# EAGLE design ESP07_Tool (EAGLE 7.3.0)
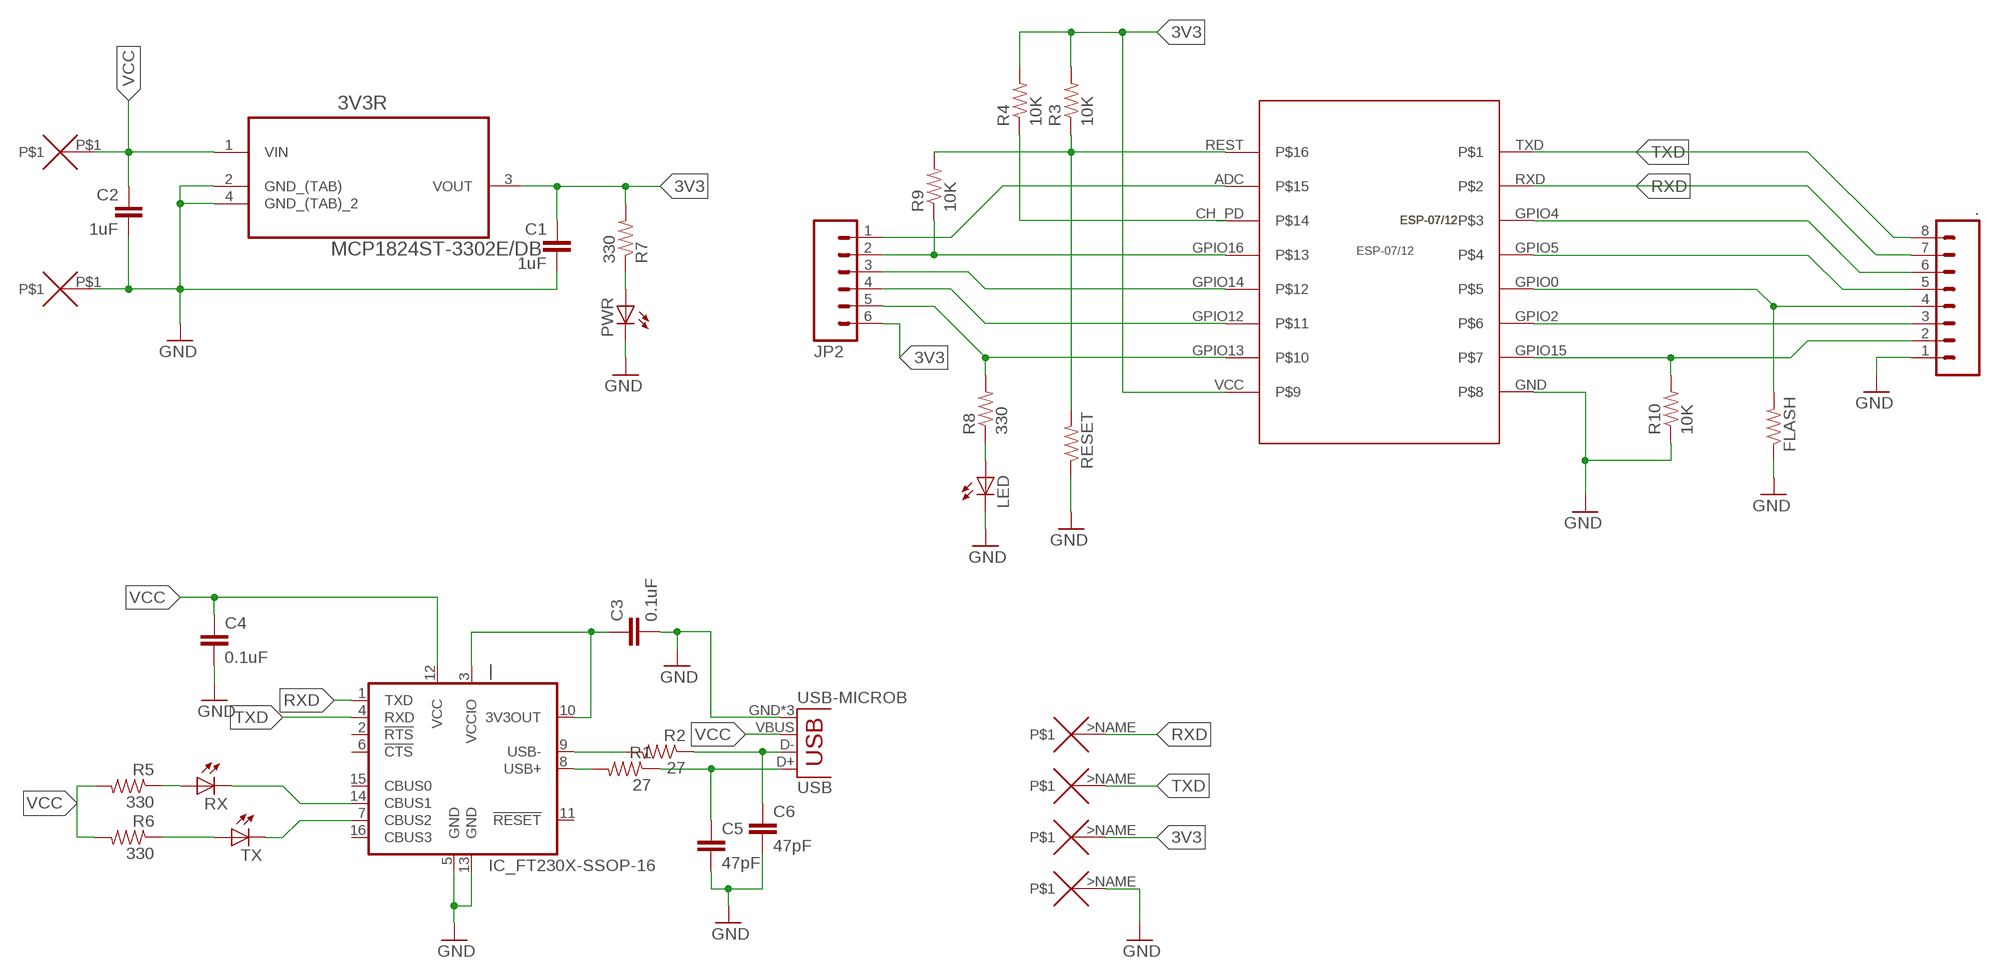
[diagram p0: schematic, sheet 1]

## Parts
3V3R  MCP1824ST-3302E/DB  [SOT230P700X180-4N]
.  M08SILK_FEMALE_PTH  [1X08]
C1  1uF  CAP  [0805-CAP]
C2  1uF  CAP  [0805-CAP]
C3  0.1uF  CAP  [0805-CAP]
C4  0.1uF  CAP  [0805-CAP]
C5  47pF  CAP  [0805-CAP]
C6  47pF  CAP  [0805-CAP]
FLASH  RESISTOR2010  [R2010]
JP2  M06SILK_FEMALE_PTH  [1X06]
LED  LEDCHIPLED_0805  [CHIPLED_0805]
PWR  LEDCHIPLED_0805  [CHIPLED_0805]
R1  27  RESISTOR0805-RES  [0805]
R2  27  RESISTOR0805-RES  [0805]
R3  10K  RESISTOR0805-RES  [0805]
R4  10K  RESISTOR0805-RES  [0805]
R5  330  RESISTOR0805-RES  [0805]
R6  330  RESISTOR0805-RES  [0805]
R7  330  RESISTOR0805-RES  [0805]
R8  330  RESISTOR0805-RES  [0805]
R9  10K  RESISTOR0805-RES  [0805]
R10  10K  RESISTOR0805-RES  [0805]
RESET  RESISTOR2010  [R2010]
RX  LEDCHIPLED_0805  [CHIPLED_0805]
TX  LEDCHIPLED_0805  [CHIPLED_0805]
U$1  ESP-07/12  [ESP-07/12]
U$2  SMD-PAD-SM  [SMD-PAD3]
U$3  SMD-PAD-SM  [SMD-PAD3]
U$4  SMD-PAD1  [SMD-PAD1]
U$5  SMD-PAD1  [SMD-PAD1]
U$6  SMD-PAD1  [SMD-PAD1]
U$7  SMD-PAD1  [SMD-PAD1]
USB  USB-MICROB  [USB-MICROB]
|  IC_FT230X-SSOP-16  [SSOP-16-FTDI]

## Nets
3V3: 3V3R.3(VOUT) C1.1 JP2.6 R3.2 R4.2 R7.2 U$1.VCC U$6.>NAME
GND: 3V3R.2(GND_(TAB)) 3V3R.4(GND_(TAB)_2) ..1 C1.2 C2.2 C3.2 C4.2 C5.2 C6.2 FLASH.1 LED.C PWR.C R10.1 RESET.1 U$1.GND U$2.P$1 U$7.>NAME USB.GND USB.MT1(GND) USB.MT2(GND) |.5(GND) |.13(GND)
N$1: JP2.3 U$1.GPIO14
N$2: LED.A R8.1
N$3: ..6 U$1.GPIO4
N$4: PWR.A R7.1
N$5: C3.1 |.3(VCCIO) |.10(3V3OUT)
N$6: TX.C |.7(CBUS2)
N$7: ..3 U$1.GPIO2
N$8: ..2 R10.2 U$1.GPIO15
N$9: ..5 U$1.GPIO5
N$10: ..4 FLASH.2 U$1.GPIO0
N$11: R4.1 U$1.CH_PD
N$12: JP2.1 U$1.ADC
N$13: RX.C |.14(CBUS1)
N$14: R5.1 RX.A
N$15: JP2.2 R9.1 U$1.GPIO16
N$17: JP2.4 U$1.GPIO12
N$18: JP2.5 R8.2 U$1.GPIO13
N$19: R6.1 TX.A
N$20: R2.2 |.9(USB-)
N$21: R1.2 |.8(USB+)
N$22: R3.1 R9.2 RESET.2 U$1.REST
N$23: C6.1 R2.1 USB.D-
N$26: C5.1 R1.1 USB.D+
RXD: ..7 U$1.RXD U$4.>NAME |.1(TXD)
TXD: ..8 U$1.TXD U$5.>NAME |.4(RXD)
VCC: 3V3R.1(VIN) C2.1 C4.1 R5.2 R6.2 U$3.P$1 USB.VBUS |.12(VCC)
Unconnected: |.2(!RTS) |.6(!CTS) |.11(!RESET) |.15(CBUS0) |.16(CBUS3)

## Library data of the parts
3V3R = Microchip_By_element14_Batch_1:MCP1824ST-3302E/DB: IC, LDO VOLT REG, 3.3V, 0.3A,; MPN: MCP1824ST-3302E/DB; OC_FARNELL: 1578379; OC_NEWARK: 05N1293; PACKAGE: SOT-223-3; SUPPLIER: Microchip
. = SparkFun-Connectors:M08: Header 8 Standard 8-pin 0.1" header. Use with straight break away headers (SKU : PRT-00116), right angle break away headers (PRT-00553), swiss pins (PRT-00743), machine pins (PRT-00117), and female headers (PRT-00115).; PROD_ID: CONN-08438
C1-C6 = SparkFun-Capacitors:CAP: Capacitor Standard 0603 ceramic capacitor, and 0.1" leaded capacitor.
FLASH R1-R10 RESET = SparkFun-Resistors:RESISTOR: Resistor Basic schematic elements and footprints for 0603, 1206, and PTH resistors.
JP2 = SparkFun-Connectors:M06: Header 6 Standard 6-pin 0.1" header. Use with straight break away headers (SKU : PRT-00116), right angle break away headers (PRT-00553), swiss pins (PRT-00743), machine pins (PRT-00117), and female headers (PRT-00115). Molex polarized connector foot print use with SKU : PRT-08094 with associated crimp pins and housings. NOTES ON THE VARIANTS LOCK and LOCK_LONGPADS... This footprint was designed to help hold the alignment of a through-hole component (i.e. 6-pin header) while soldering it into place. You may notice that each hole has been shifted either up or down by 0.005 of an inch from it's more standard position (which is a perfectly straight line). This slight alteration caused the pins (the squares in the middle) to touch the edges of the holes. Because they are alternating, it causes a "brace" to hold the component in place. 0.005 has proven to be the perfect amount of "off-center" position when using our standard breakaway headers. Although looks a little odd when you look at the bare footprint, once you have a header in there, the alteration is very hard to notice. Also,if you push a header all the way into place, it is covered up entirely on the bottom side. This idea of altering the position of holes to aid alignment will be further integrated into the Sparkfun Library for other footprints. It can help hold any component with 3 or more connection pins.; PROD_ID: CONN-08437
LED PWR RX TX = led:LED: LED OSRAM: - CHIPLED LG R971, LG N971, LY N971, LG Q971, LY Q971, LO R971, LY R971 LH N974, LH R974 LS Q976, LO Q976, LY Q976 LO Q996 - Hyper CHIPLED LW Q18S LB Q993, LB Q99A, LB R99A - SideLED LS A670, LO A670, LY A670, LG A670, LP A670 LB A673, LV A673, LT A673, LW A673 LH A674 LY A675 LS A676, LA A676, LO A676, LY A676, LW A676 LS A679, LY A679, LG A679 - Hyper Micro SIDELEDÂ® LS Y876, LA Y876, LO Y876, LY Y876 LT Y87S - SmartLED LW L88C, LW L88S LB L89C, LB L89S, LG L890 LS L89K, LO L89K, LY L89K LS L896, LA L896, LO L896, LY L896 - TOPLED LS T670, LO T670, LY T670, LG T670, LP T670 LSG T670, LSP T670, LSY T670, LOP T670, LYG T670 LG T671, LOG T671, LSG T671 LB T673, LV T673, LT T673, LW T673 LH T674 LS T676, LA T676, LO T676, LY T676, LB T676, LH T676, LSB T676, LW T676 LB T67C, LV T67C, LT T67C, LS T67K, LO T67K, LY T67K, LW E67C LS E67B, LA E67B, LO E67B, LY E67B, LB E67C, LV E67C, LT E67C LW T67C LS T679, LY T679, LG T679 LS T770, LO T770, LY T770, LG T770, LP T770 LB T773, LV T773, LT T773, LW T773 LH T774 LS E675, LA E675, LY E675, LS T675 LS T776, LA T776, LO T776, LY T776, LB T776 LHGB T686 LT T68C, LB T68C - Hyper Mini TOPLEDÂ® LB M676 - Mini TOPLED SantanaÂ® LG M470 LS M47K, LO M47K, LY M47K Source: http://www.osram.convergy.de LUXEON: - LUMILEDÂ® LXK2-PW12-R00, LXK2-PW12-S00, LXK2-PW14-U00, LXK2-PW14-V00 LXK2-PM12-R00, LXK2-PM12-S00, LXK2-PM14-U00 LXK2-PE12-Q00, LXK2-PE12-R00, LXK2-PE12-S00, LXK2-PE14-T00, LXK2-PE14-U00 LXK2-PB12-K00, LXK2-PB12-L00, LXK2-PB12-M00, LXK2-PB14-N00, LXK2-PB14-P00, LXK2-PB14-Q00 LXK2-PR12-L00, LXK2-PR12-M00, LXK2-PR14-Q00, LXK2-PR14-R00 LXK2-PD12-Q00, LXK2-PD12-R00, LXK2-PD12-S00 LXK2-PH12-R00, LXK2-PH12-S00 LXK2-PL12-P00, LXK2-PL12-Q00, LXK2-PL12-R00 Source: www.luxeon.com KINGBRIGHT: KA-3528ASYC Source: www.kingbright.com
U$1 = ESP-07_12:ESP-07/12: Version 1.0 of the library for the ESP-07/12 full GPIO dev board module byME Jon jonnyradu@gmail.com
U$2 U$3 = CuriousTech:SMD-PAD-SM: SMD-PAD
U$4-U$7 = CuriousTech:SMD-PAD1: SMD-PAD small
USB = SparkFun-Connectors:USB: USB Connectors USB-B-PTH is fully proven SKU : PRT-00139/CONN-08278 USB-miniB is fully proven SKU : PRT-00587 USB-A-PCB is untested. USB-A-H is throughly reviewed, but untested. Spark Fun Electronics SKU : PRT-00437 USB-B-SMT is throughly reviewed, but untested. Needs silkscreen touching up. USB-A-S has not been used/tested USB-MB-H has not been used/tested USB-MICROB has been used. CONN-09505; PROD_ID: CONN-09505
| = dp_devices:IC_FT230X: BASIC USB to UART IC

## Board
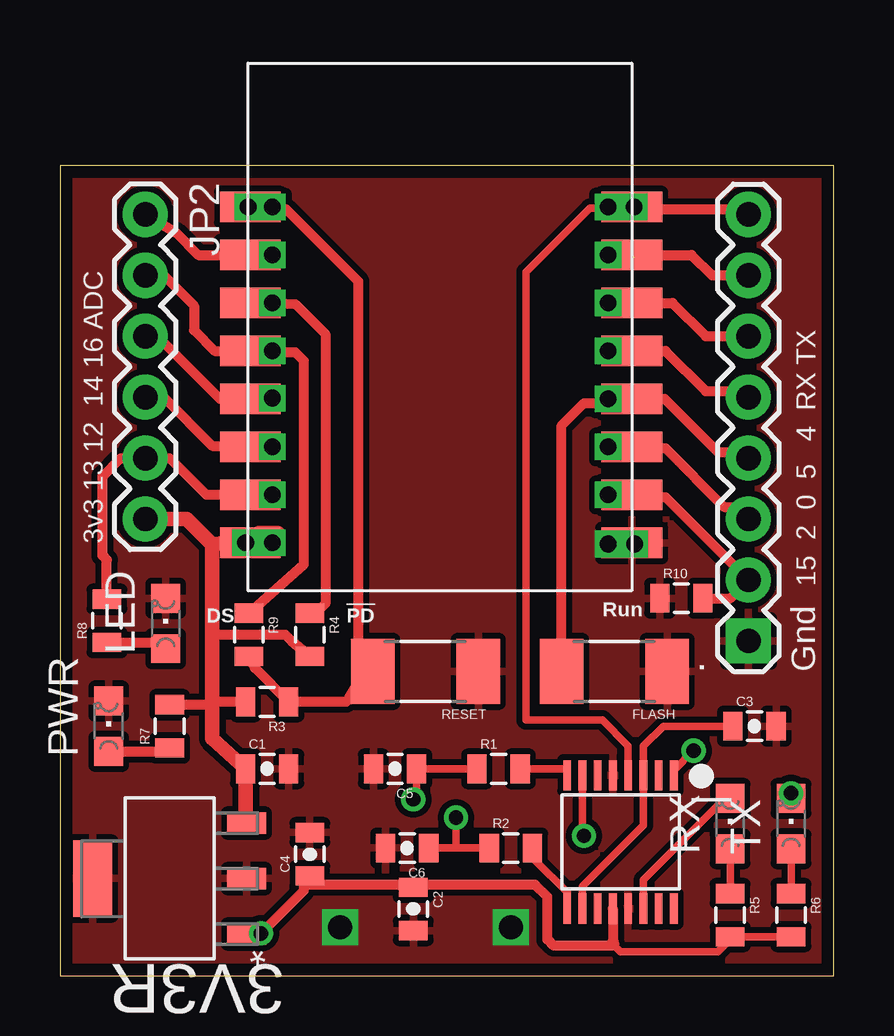
[diagram p1: board, top side]
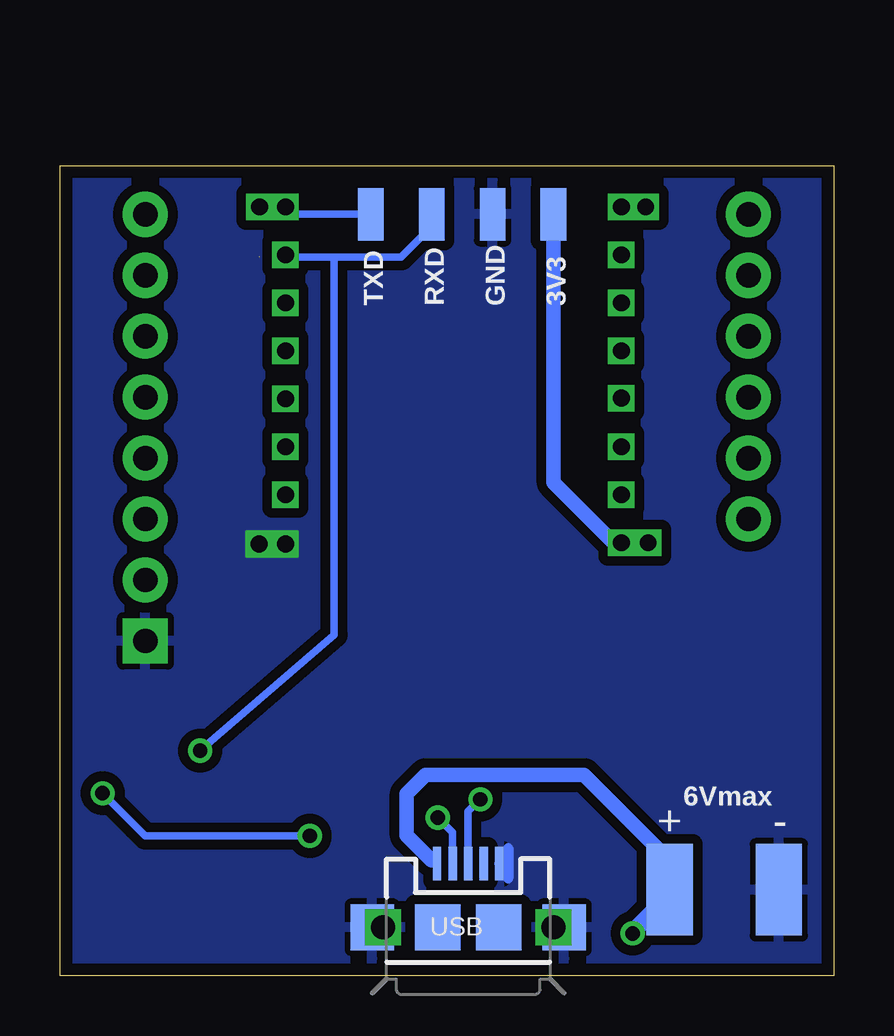
[diagram p2: board, bottom side, seen from below]

Size 32.26 x 33.78 mm. Coordinates in mm from the lower left corner, seen from the top.
Outline: 0,0 32.26,0 32.26,33.78 0,33.78 0,0
Copper layers (1*16): Top 0.035mm / dielectric 1.5mm / Bottom 0.035mm
Design rules "default *": minimum track width 10mil, minimum drill 24mil, track to track 8mil, track to pad 8mil, pad to pad 8mil, via to via 8mil, smd to smd 8mil, copper to edge 20mil, drill to drill 8mil, minimum pad ring 10mil, minimum via ring 8mil, stop-mask expansion 4mil, vias tented up to drill 0mil, thermal gap 10mil

### Footprints (pad centres in the part's own frame; a part is rotated, then mirrored left to right if it is on the bottom)
SOT230P700X180-4N = smd 1.626 x 0.889: 1 -3.2,2.311; 2 -3.2,0; 3 -3.2,-2.311 | smd 1.626 x 3.175: 4 3.2,0
1X08 = drill 1.016 pad 1.88 square: 1 0,0 | drill 1.016 pad 1.88: 2 2.54,0; 3 5.08,0; 4 7.62,0; 5 10.16,0; 6 12.7,0; 7 15.24,0; 8 17.78,0
0805-CAP = smd 0.8 x 1.2: 1 -0.9,0; 2 0.9,0
R2010 = smd 1.8 x 2.7: 1 -2.2,0; 2 2.2,0
1X06 = drill 1.016 pad 1.88: 1 0,0; 2 2.54,0; 3 5.08,0; 4 7.62,0; 5 10.16,0; 6 12.7,0
CHIPLED_0805 = smd 1.2 x 1.2: A 0,-1.05; C 0,1.05
0805 = smd 0.8 x 1.2: 1 -0.9,0; 2 0.9,0
ESP-07/12 = smd 2.54 x 1.27: ADC 0.1,14; CH_PD 0.1,12; GND 16,2; GPIO0 16,8; GPIO2 16,6; GPIO4 16,12; GPIO5 16,10; GPIO12 0.1,6; GPIO13 0.1,4; GPIO14 0.1,8; GPIO15 16,4; GPIO16 0.1,10; REST 0.1,16; RXD 16,14; TXD 16,16; VCC 0.1,2
SMD-PAD3 = smd 3.81 x 1.93: P$1 0,0
SMD-PAD1 = smd 2.184 x 1.067: >NAME 0,0
USB-MICROB = smd 0.35 x 1.4: D+ 0,2.65; D- -0.65,2.65; GND 1.3,2.65; ID 0.65,2.65; VBUS -1.3,2.65 | smd 1.8 x 1.9: MT1 -4,0; MT2 4,0 | smd 1.9 x 1.9: P$1 -1.27,0; P$2 1.27,0
SSOP-16-FTDI = smd 0.32 x 1.26: 1 -2.223,-2.779; 2 -1.588,-2.779; 3 -0.953,-2.779; 4 -0.318,-2.779; 5 0.317,-2.779; 6 0.952,-2.779; 7 1.587,-2.779; 8 2.222,-2.779; 9 2.222,2.779; 10 1.587,2.779; 11 0.952,2.779; 12 0.317,2.779; 13 -0.318,2.779; 14 -0.953,2.779; 15 -1.588,2.779; 16 -2.223,2.779

### Placement (x,y rotation side)
3V3R  4.57,4.06 180 top
.  28.7,13.97 90 top
C1  8.64,8.64 0 top
C2  14.73,2.79 270 top
C3  28.96,10.41 0 top
C4  10.41,5.08 90 top
C5  13.97,8.64 180 top
C6  14.48,5.33 180 top
FLASH  23.11,12.7 180 top
JP2  3.56,31.75 270 top
LED  4.41,14.69 0 top
PWR  2.03,10.41 0 top
R1  18.29,8.64 0 top
R2  18.8,5.33 0 top
R3  8.64,11.43 180 top
R4  10.41,14.22 270 top
R5  27.94,2.54 270 top
R6  30.48,2.54 270 top
R7  4.57,10.41 90 top
R8  1.96,14.81 90 top
R9  7.87,14.22 270 top
R10  25.91,15.75 0 top
RESET  15.24,12.7 180 top
RX  27.94,6.35 0 top
TX  30.48,6.35 0 top
U$1  7.84,16.06 0 top
U$2  2.29,3.6 90 bottom
U$3  6.84,3.6 90 bottom
U$4  16.76,31.75 90 bottom
U$5  19.3,31.75 270 bottom
U$6  11.68,31.75 270 bottom
U$7  14.22,31.75 270 bottom
USB  15.24,2.03 0 bottom
|  23.37,5.59 180 top

### Tracks (layer width: path | path; a pad name or v marks a point on that pad's centre or on a via)
3V3  (via drill 0.7)
  Top 0.406: v8.86,18.06 7.94,18.01 U$1.VCC 8.66,18.06 9.14,18.54 8.22,18.54 v7.74,18.06 | R3.2 6.35,11.43 6.23,11.31 R7.2 | R4.2 9.65,13.97 9.4,14.22 6.35,14.22
  Top 0.61: 6.35,17.99 6.35,14.22 6.35,11.43 6.35,9.91 C1.1 7.74,6.41 3V3R.3 | 6.35,17.99 6.94,18.07 v8.86,18.06 | JP2.6 5.29,19.05 6.35,17.99
  Bottom 0.61: v8.86,18.06 8.15,18 8.07,18 8.01,18.03 9.14,18.03 11.68,20.57 U$6.>NAME 11.68,31.61
GND  (via drill 0.7, 1)
  Bottom 0.406: 13.56,5.33 13.56,4.57 | 13.56,4.57 13.56,4.06 | USB.GND 13.67,4.68 13.56,4.57
  other vias: 11.68,2.03 18.8,2.03 23.96,18.01 22.86,18.01
  pour Top (isolate 0.254): 0,33.78 32.51,33.78 32.51,0 0,0
  pour Bottom (isolate 0.406): 0,0 0,33.78 8.2,33.71 32.51,33.78 32.51,0
N$1  (via drill 0.7)
  Top 0.406: v8.86,24.09 8.81,24.06 U$1.GPIO14 6.67,24.06 4.32,26.42 3.81,26.42 JP2.3
N$2
  Top 0.406: R8.1 4.15,13.91 LED.A
N$3  (via drill 0.7)
  Top 0.406: v22.86,28.06 U$1.GPIO4 25.53,28.06 26.92,26.67 ..6
N$4
  Top 0.406: PWR.A 4.17,9.36 R7.1
N$5
  Top 0.305: |.10 21.78,3.75 24.32,6.29 |.3 24.32,9.6 25.15,10.41 C3.1
N$6  (via drill 0.6)
  Top 0.305: 30.73,7.37 TX.C v30.48,7.62 | |.7 21.78,5.91 v21.84,5.84
  Bottom 0.305: v30.48,7.62 28.7,5.84 v21.84,5.84
N$7  (via drill 0.7)
  Top 0.406: 24.22,22.1 23.04,21.91 23.04,22.06 v22.86,22.06 | 24.22,22.1 24.38,22 25.24,22 27.69,19.56 28.19,19.56 ..3 | 24.22,22.1 23.84,21.84 U$1.GPIO2
N$8  (via drill 0.7)
  Top 0.406: 23.71,19.92 22.95,19.89 22.95,20.06 v22.86,20.06 | 23.71,19.92 24.84,19.97 25.24,19.97 ..2 27.94,15.75 R10.2 | U$1.GPIO15 23.71,20.06 23.71,19.92
N$9  (via drill 0.7)
  Top 0.406: v22.86,26.06 U$1.GPIO5 25.25,26.06 26.92,24.38 28.45,24.38 ..5
N$10  (via drill 0.7)
  Top 0.406: FLASH.2 20.91,22.95 21.84,23.88 22.75,23.88 v22.86,24.06 U$1.GPIO0 25.22,24.06 27.43,21.84 28.45,21.84 ..4
N$11  (via drill 0.7)
  Top 0.406: R4.1 10.53,14.99 11.07,15.53 11.07,26.75 9.82,28 9.06,28.06 v8.86,28.06 U$1.CH_PD 7.94,28
N$12  (via drill 0.7)
  Top 0.406: 6.87,29.99 v8.86,30.06 U$1.ADC 5.76,30.06 4.83,30.99 JP2.1
N$13
  Top 0.305: RX.C 27.72,7.4 24.32,4 |.14
N$14
  Top 0.305: R5.1 RX.A
N$15  (via drill 0.7)
  Top 0.406: U$1.GPIO16 7.94,26 9.81,26 10.16,25.65 10.16,17.16 R9.1 | U$1.GPIO16 v8.86,26.06 | JP2.2 4.32,29.21 5.59,27.94 5.59,26.92 6.45,26.06 U$1.GPIO16
N$16
  Bottom 0.61: 7.11,3.3 7.11,3.05 8.38,1.78
N$17  (via drill 0.7)
  Top 0.406: v8.86,22.06 U$1.GPIO12 7.9,22.1 6.35,22.1 4.32,24.13 JP2.4
N$18  (via drill 0.7)
  Top 0.406: 7.94,20 U$1.GPIO13 | U$1.GPIO13 v8.86,20.06 | U$1.GPIO13 6.1,20.07 4.57,21.59 JP2.5 2.54,21.59 1.78,20.83 1.78,17.53 1.96,17.35 R8.2
N$19
  Top 0.305: R6.1 TX.A
N$20
  Top 0.305: R2.2 19.81,5.33 19.81,4.83 21.15,3.49 |.9
N$21
  Top 0.305: R1.2 21.13,8.64 |.8
N$22  (via drill 0.7)
  Top 0.406: 8.14,31.97 9.43,31.97 12.45,28.96 12.45,13.38 RESET.2 12.7,12.7 11.94,11.43 R3.1 8.13,12.84 R9.2 | 8.14,31.97 6.91,31.97 | U$1.REST 8.14,32.06 8.14,31.97 | U$1.REST v8.86,32.06 | U$1.REST v7.84,32.06
N$23  (via drill 0.6)
  Top 0.305: 17.92,5.47 R2.1 16.51,5.33 | C6.1 16.51,5.33 | 16.51,5.33 v16.51,6.6
  Bottom 0.305: USB.D- 15.89,5.98 v16.51,6.6
N$26  (via drill 0.6)
  Top 0.305: R1.1 C5.1 14.87,7.5 v14.73,7.37
  Bottom 0.305: USB.D+ 15.24,6.86 v14.73,7.37
RXD  (via drill 0.6, 0.7)  (1 unrouted)
  Top 0.305: 24.35,29.97 24.34,29.97 | |.1 25.59,8.57 v26.42,9.4
  Top 0.406: 23.94,29.98 23.94,30.06 26.33,30.06 27.18,29.21 ..7 | v22.86,30.06 U$1.RXD 23.93,29.97 24.34,29.97
  Bottom 0.305: v26.42,9.4 20.83,14.22 20.83,29.97 | U$4.>NAME 16.76,31.24 18.03,29.97 20.83,29.97 | 20.83,29.97 22.77,29.97 v22.86,30.06 22.89,30.06 22.89,30 22.86,29.97
  Bottom 0.61: 16.76,31.59 U$4.>NAME
TXD  (via drill 0.7)
  Top 0.305: |.4 23.69,9.59 22.61,10.67 19.43,10.67 19.43,29.34 22.1,32 22.79,32 v22.86,32.06 24.52,31.96
  Top 0.406: v23.94,32.06 U$1.TXD 23.84,31.96 24.52,31.96 28.49,31.96 ..8
  Bottom 0.305: U$5.>NAME 22.86,31.75 v22.86,32.06
  Bottom 0.61: 19.3,31.73 U$5.>NAME
VCC  (via drill 0.6)
  Top 0.305: R6.2 R5.2 28.06,1.64 27.43,1.02 23.37,1.02 23.11,1.27 23.05,1.33
  Top 0.406: |.12 23.05,1.46 | 23.05,1.33 23.05,1.46 | 23.05,1.46 23.11,1.27 20.57,1.27 20.32,1.52 20.32,3.3 19.81,3.81 14.62,3.81 | 13.97,3.81 C2.1 14.62,3.81 | 13.97,3.81 10.41,3.81 | 10.41,3.81 C4.1 | 14.62,3.81 13.97,3.81 | 10.41,3.81 10.16,4.06 10.16,3.56 v8.38,1.78
  Top 0.61: v8.38,1.78 3V3R.1
  Bottom 0.305: USB.VBUS 16.76,4.68 16.76,4.83
  Bottom 0.406: 17.81,5.87 17.78,5.84 | v8.38,1.78 8.38,2.06 U$3.P$1
  Bottom 0.61: 17.78,5.84 16.76,4.83 | 17.81,5.87 17.81,7.59 17.02,8.38 10.41,8.38 6.86,4.83 U$3.P$1

### Text on the board
tPlace: 3v3 13 12 14 16 ADC | 15 2 0 5 4 RX TX | DS | !PD | Run | Gnd
bPlace: 3V3 | GND | RXD | TXD | 6Vmax | - | +
tStop: ESP-07/12 | USB Tool
bStop: CuriousTech.net